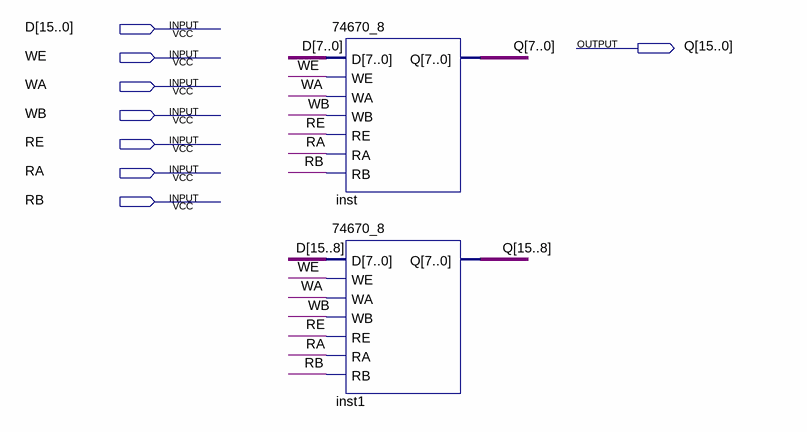
[diagram p0: schematic sheet]
// Quartus schematic 74670_16.bdf as structural Verilog: 2 symbols, 8 pins
module \74670_16  (
  input  [15:0] D,
  input  WE,
  input  WA,
  input  WB,
  input  RE,
  input  RA,
  input  RB,
  output [15:0] Q
);

  \74670_8  inst (.D(D[7:0]), .WE(WE), .WA(WA), .WB(WB), .RE(RE), .RA(RA), .RB(RB), .Q(Q[7:0]));
  \74670_8  inst1 (.D(D[15:8]), .WE(WE), .WA(WA), .WB(WB), .RE(RE), .RA(RA), .RB(RB), .Q(Q[15:8]));
endmodule
